# Altium schematic sheet TDS_EZO_2.SchDoc
size A4
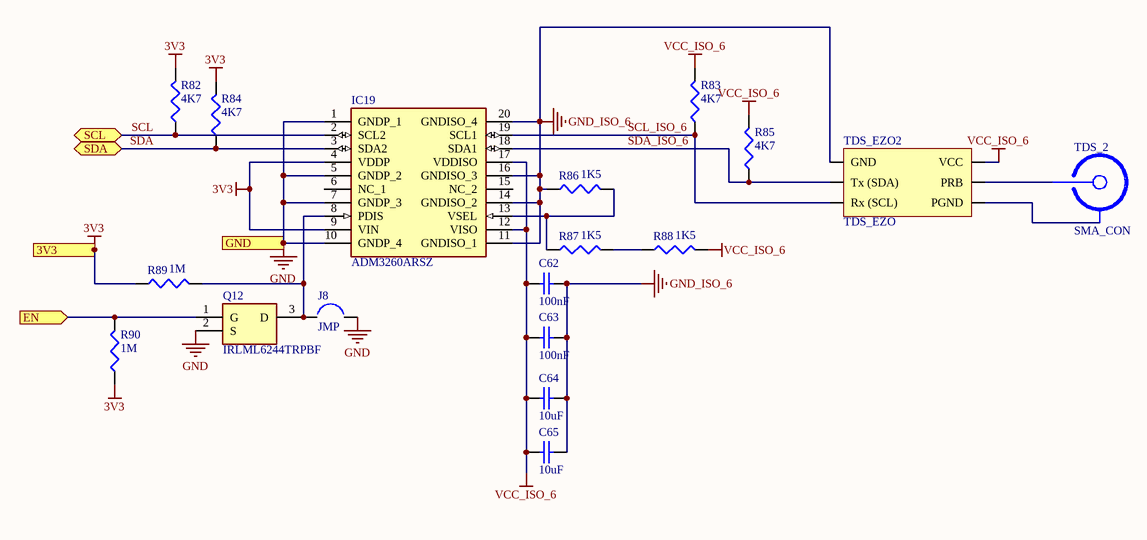
[diagram p0: TDS_EZO_2.SchDoc]

## Parts
C62  100nF  [1608[0603]]
C63  100nF  [1608[0603]]
C64  10uF  [1608[0603]]
C65  10uF  [1608[0603]]
IC19  ADM3260ARSZ  [SOP65P780X200-20N]
J8  JMP  [Jumper]
Q12  IRLML6244TRPBF  [SOT95P237X112-3N]
R82  4K7  [J1-0603]
R83  4K7  [J1-0603]
R84  4K7  [J1-0603]
R85  4K7  [J1-0603]
R86  1K5  [J1-0603]
R87  1K5  [J1-0603]
R88  1K5  [J1-0603]
R89  1M  [J1-0603]
R90  1M  [J1-0603]
TDS_2  SMA_CON  [PCBSMAFRAHT]
TDS_EZO2  TDS_EZO  [TDS_EZO]

## Ports
3V3, EN (in), GND, SCL (bidir), SDA (bidir)

## Nets
3V3: IC19.4(VDDP) IC19.9(VIN) R82.2 R84.2 R89.1 R90.1 ; port 3V3
GND: IC19.1(GNDP_1) IC19.5(GNDP_2) IC19.7(GNDP_3) IC19.10(GNDP_4) J8.2 Q12.2(S) ; port GND
GND_ISO_6: C62.2 C63.2 C64.2 C65.2 IC19.11(GNDISO_1) IC19.14(GNDISO_2) IC19.16(GNDISO_3) IC19.20(GNDISO_4) R86.1 TDS_EZO2.1(GND)
VCC_ISO_6: C62.1 C63.1 C64.1 C65.1 IC19.12(VISO) IC19.17(VDDISO) R83.2 R85.2 R88.2 TDS_EZO2.4(VCC)
EN: Q12.1(G) R90.2 ; port EN
SCL: IC19.2(SCL2) R82.1 ; port SCL
SCL_ISO_6: IC19.19(SCL1) R83.1 TDS_EZO2.3(Rx_(SCL))
SDA: IC19.3(SDA2) R84.1 ; port SDA
SDA_ISO_6: IC19.18(SDA1) R85.1 TDS_EZO2.2(Tx_(SDA))
NetIC19_8: IC19.8(PDIS) J8.1 Q12.3(D) R89.2
NetIC19_13: IC19.13(VSEL) R86.2 R87.1
NetR87_2: R87.2 R88.1
NetTDS_2_1: TDS_2.1 TDS_EZO2.5(PRB)
NetTDS_2_2: TDS_2.2 TDS_EZO2.6(PGND)

Not connected (* = marked no-connect by the designer): IC19 6(NC_1) 15(NC_2)

## Library data of the parts
C62 C63 = Cap Semi: Capacitor (Semiconductor SIM Model); Published: 8-Jun-2000; LatestRevisionDate: 29-May-2009; LatestRevisionNote: IPC-7351 Footprint Added.; PackageReference: C1206; Publisher: Altium Limited; PackageDescription: Chip Capacitor; Value: 100nF
C64 C65 = Cap Semi: Capacitor (Semiconductor SIM Model); Value: 100nF; Published: 8-Jun-2000; LatestRevisionDate: 29-May-2009; LatestRevisionNote: IPC-7351 Footprint Added.; PackageReference: C1206; Publisher: Altium Limited; PackageDescription: Chip Capacitor
IC19 = ADM3260ARSZ: Integrated Circuit; Manufacturer_Name: Analog Devices; Datasheet Link: http://www.farnell.com/datasheets/2037088.pdf; Height: 2mm; Manufacturer_Part_Number: ADM3260ARSZ; Mouser Part Number: 584-ADM3260ARSZ; Mouser Price/Stock: https://www.mouser.com/Search/Refine.aspx?Keyword=584-ADM3260ARSZ; RS Part Number: 8319113P; RS Price/Stock: http://uk.rs-online.com/web/p/products/8319113P
Q12 = IRLML6244TRPBF: Transistor; Manufacturer_Name: Infineon; Allied_Number: 70411468; Datasheet Link: http://www.infineon.com/dgdl/irlml6244pbf.pdf?fileId=5546d462533600a4015356686fed261f; Height: 1.12mm; Manufacturer_Part_Number: IRLML6244TRPBF; Mouser Part Number: 942-IRLML6244TRPBF; Mouser Price/Stock: https://www.mouser.com/Search/Refine.aspx?Keyword=942-IRLML6244TRPBF; RS Part Number: 7377228P; RS Price/Stock: http://at.rs-online.com/web/p/products/7377228P; Allied Price/Stock: https://www.alliedelec.com/infineon-irlml6244trpbf/70411468/
R82-R90 = Res3: Resistor; Published: 8-Jun-2000; LatestRevisionDate: 29-May-2009; LatestRevisionNote: IPC-7351 Footprint Added.; PackageReference: J1-0603; Publisher: Altium Limited; PackageDescription: Chip Resistor
  R82-R85: Value: 4K7
  R86-R88: Value: 1K5
  R89 R90: Value: 1M
TDS_2 = SMA: Connector; Manufacturer_Name: Taoglas; Manufacturer_Part_Number: PCB.SMAFRA.HT; Datasheet Link: https://www.mouser.com/datasheet/2/398/PCB.SMAFRA.HT_-1220750.pdf; Height: 9mm; Mouser Part Number: 960-PCB.SMAFRA.HT; Mouser Price/Stock: https://www.mouser.co.uk/ProductDetail/Taoglas/PCBSMAFRAHT?qs=RuW%2Fu%252BNMQmubIFYcN8w5Dw%3D%3D